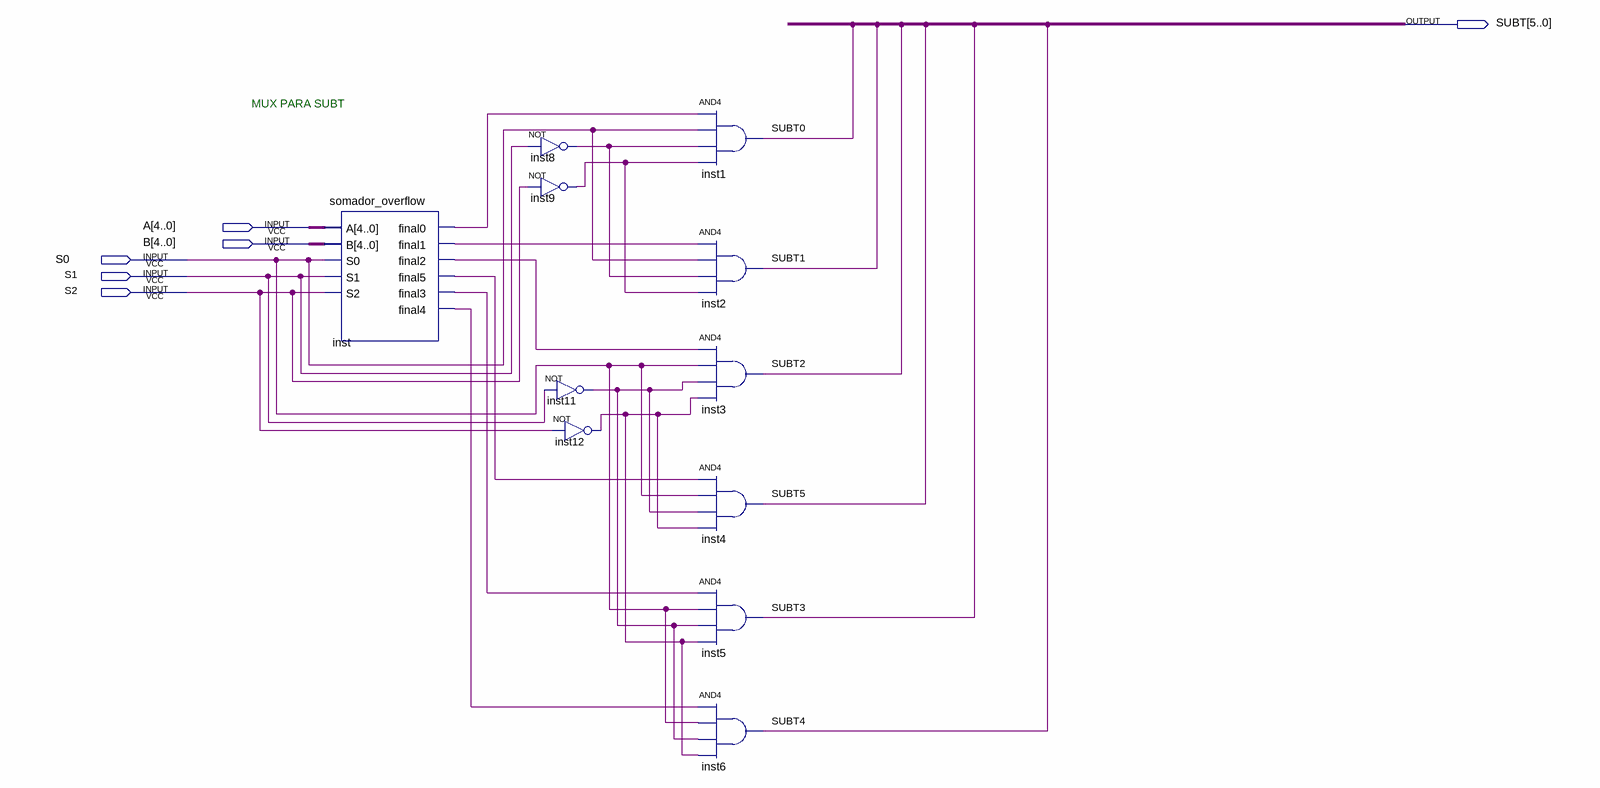
[diagram p0: schematic sheet]
// Quartus schematic MUX_SUBT.bdf as structural Verilog: 11 symbols, 6 pins
module MUX_SUBT (
  input  [4:0] A,
  input  [4:0] B,
  input  S0,
  input  S1,
  input  S2,
  output [5:0] SUBT
);

  wire inst8_out, inst9_out, inst11_out, inst12_out, inst_final0, inst_final1, inst_final2, inst_final3,
       inst_final4, inst_final5;

  somador_overflow inst (
    .A(A), .B(B), .S0(S0), .S1(S1), .S2(S2), .final0(inst_final0), .final1(inst_final1),
    .final2(inst_final2), .final5(inst_final5), .final3(inst_final3), .final4(inst_final4));
  not inst8 (inst8_out, S1);
  not inst9 (inst9_out, S2);
  not inst11 (inst11_out, S1);
  not inst12 (inst12_out, S2);
  and inst1 (SUBT[0], inst_final0, S0, inst8_out, inst9_out);
  and inst2 (SUBT[1], inst_final1, S0, inst8_out, inst9_out);
  and inst3 (SUBT[2], inst_final2, S0, inst11_out, inst12_out);
  and inst4 (SUBT[5], inst_final5, S0, inst11_out, inst12_out);
  and inst5 (SUBT[3], inst_final3, S0, inst11_out, inst12_out);
  and inst6 (SUBT[4], inst_final4, S0, inst11_out, inst12_out);

  // Notes on the sheet:
  //   MUX PARA SUBT
endmodule
